# Altium schematic sheet bolid-outputs.SchDoc
size A3
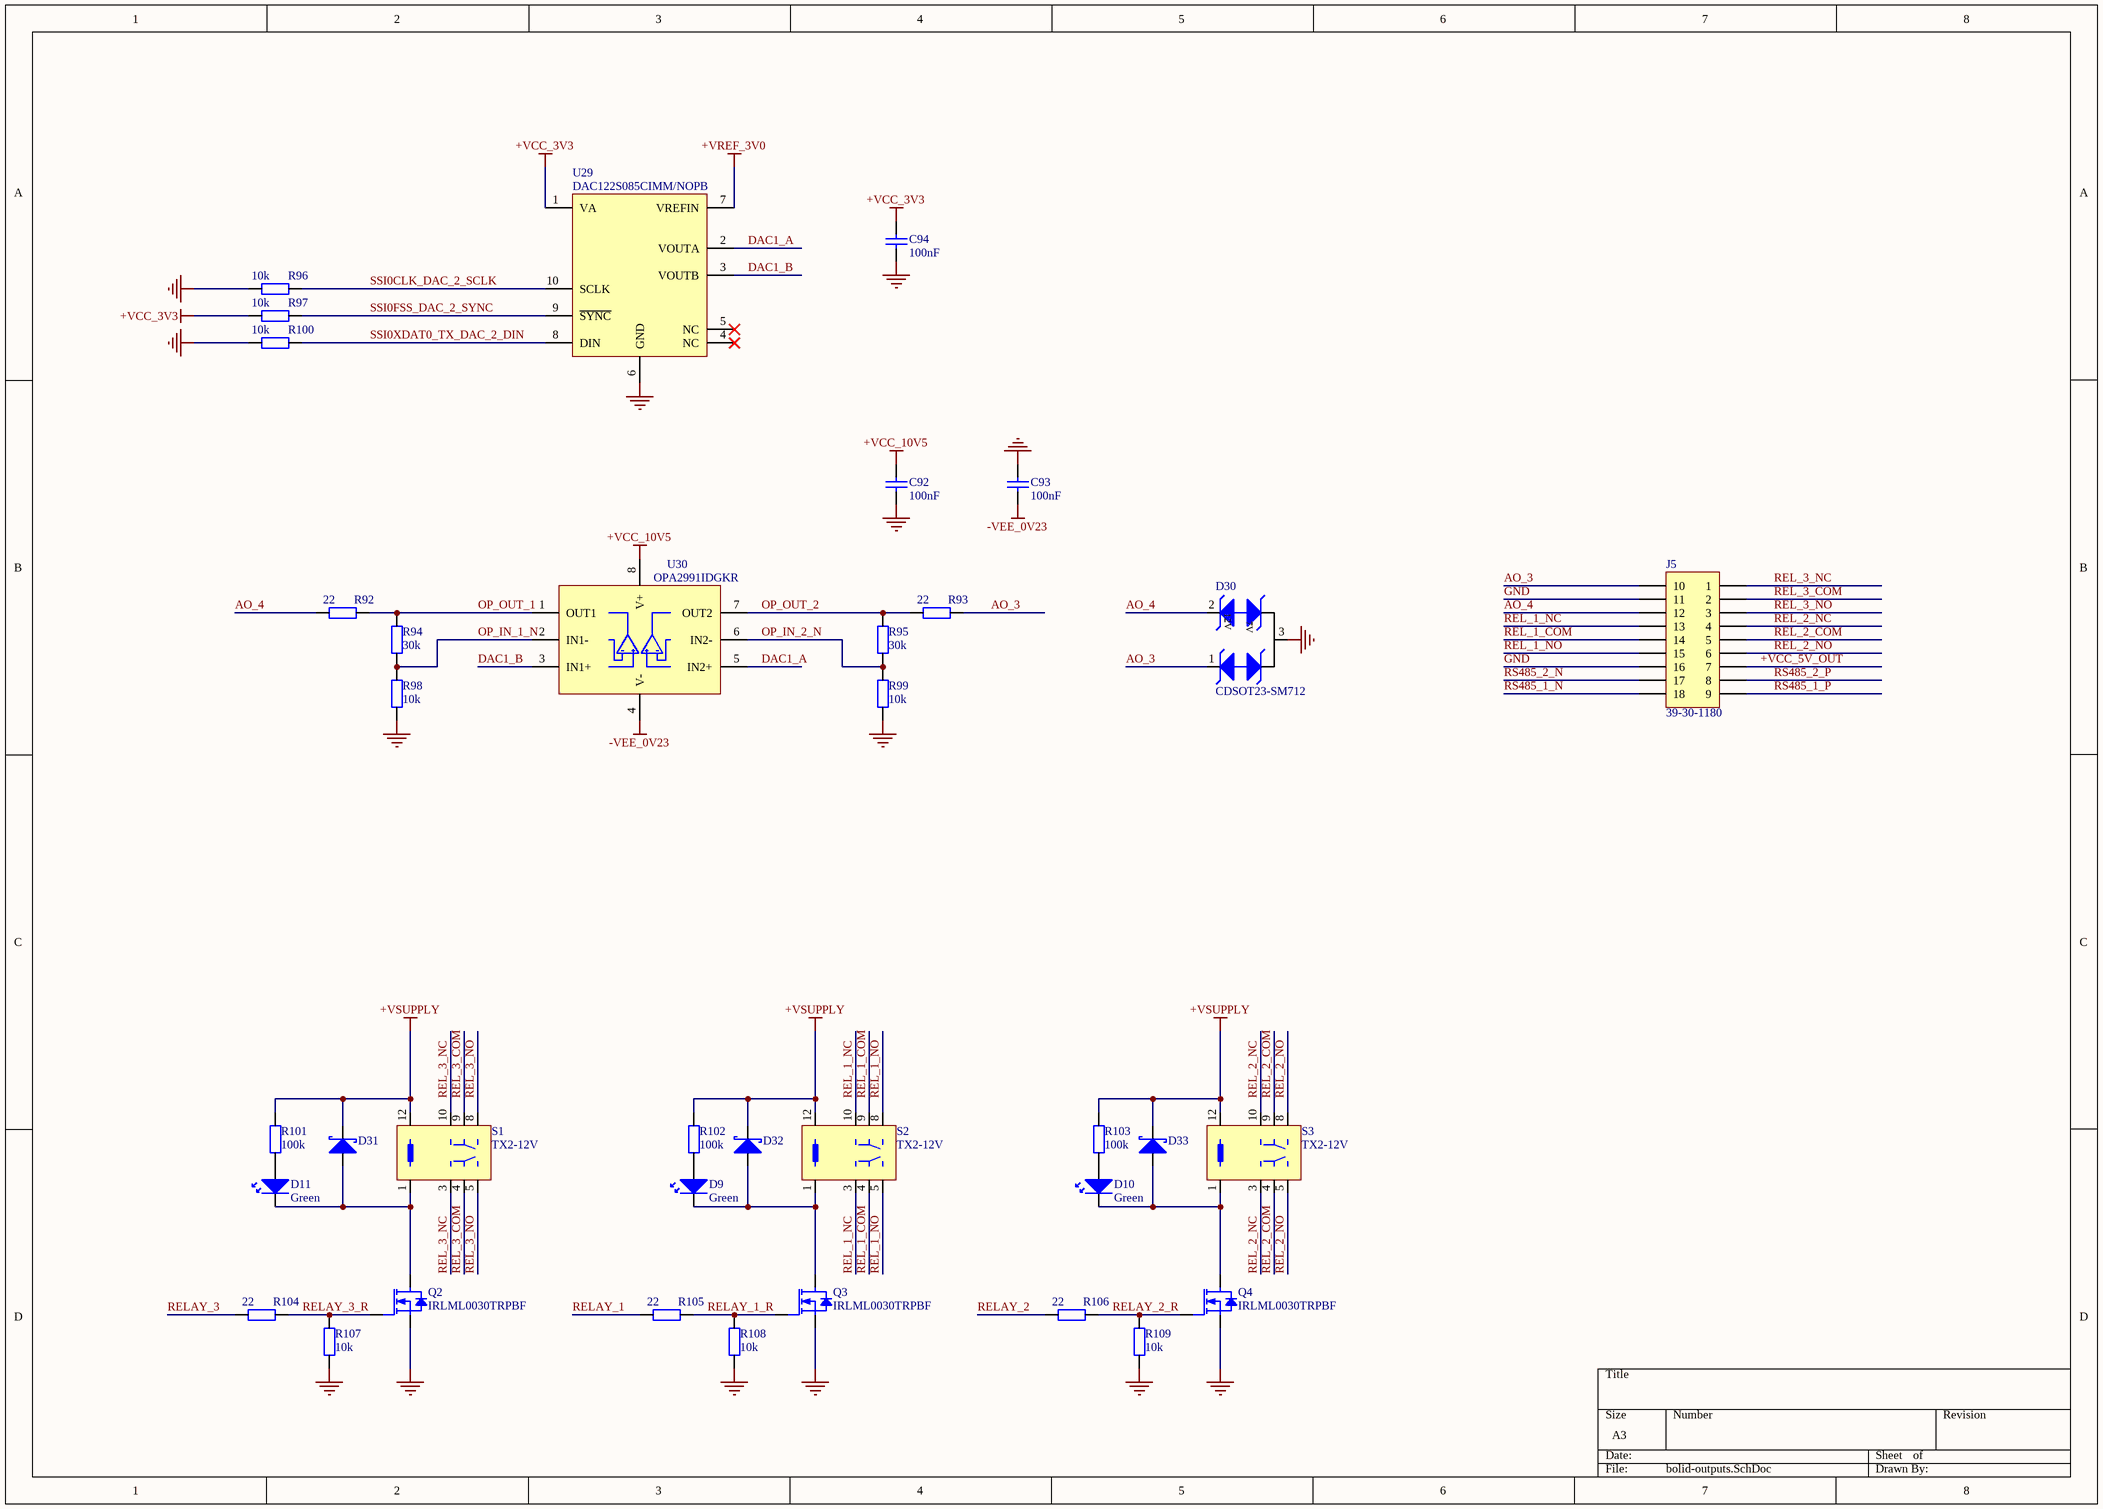
[diagram p0: bolid-outputs.SchDoc]

## Parts
C92  Value Displayed: 100nF  [C0402-CAPC100X50X55L22 - Tayio Yuden TDK]  (hidden comment: GRM155R71H104KE14D)
C93  Value Displayed: 100nF  [C0402-CAPC100X50X55L22 - Tayio Yuden TDK]  (hidden comment: GRM155R71H104KE14D)
C94  Value Displayed: 100nF  [C0402-CAPC100X50X55L22 - Tayio Yuden TDK]  (hidden comment: GRM155R71H104KE14D)
D9  Illumination Color: Green  [D0603 DIONC166X84X36L42N Littelfuse]  (hidden comment: 150060GS75000)
D10  Illumination Color: Green  [D0603 DIONC166X84X36L42N Littelfuse]  (hidden comment: 150060GS75000)
D11  Illumination Color: Green  [D0603 DIONC166X84X36L42N Littelfuse]  (hidden comment: 150060GS75000)
D30  CDSOT23-SM712  [Bourns SOT-23-3L SOT23-3P95_229X117L49X40N]
D31  MBR0530T3G  [SOD-123-2L SOD375X160X128L32X60N - Fairchild]  (value not drawn)
D32  MBR0530T3G  [SOD-123-2L SOD375X160X128L32X60N - Fairchild]  (value not drawn)
D33  MBR0530T3G  [SOD-123-2L SOD375X160X128L32X60N - Fairchild]  (value not drawn)
J5  39-30-1180  [MOLEX Mini-Fit Jr 039301180 2x9 PEG]
Q2  IRLML0030TRPBF  [SOT23-3P95_237X112L50X40N - Infineon Micro3]
Q3  IRLML0030TRPBF  [SOT23-3P95_237X112L50X40N - Infineon Micro3]
Q4  IRLML0030TRPBF  [SOT23-3P95_237X112L50X40N - Infineon Micro3]
R92  value 22  [R0402-RESC100X50X40L22N]  (hidden comment: RC0402FR-1322RL)
R93  value 22  [R0402-RESC100X50X40L22N]  (hidden comment: RC0402FR-1322RL)
R94  value 30k  [R0402-RESC100X50X40L22N]  (hidden comment: RC0402FR-1330KL)
R95  value 30k  [R0402-RESC100X50X40L22N]  (hidden comment: RC0402FR-1330KL)
R96  value 10k  [R0402-RESC100X50X40L22N]  (hidden comment: RC0402FR-0710KL)
R97  value 10k  [R0402-RESC100X50X40L22N]  (hidden comment: RC0402FR-0710KL)
R98  value 10k  [R0402-RESC100X50X40L22N]  (hidden comment: RC0402FR-0710KL)
R99  value 10k  [R0402-RESC100X50X40L22N]  (hidden comment: RC0402FR-0710KL)
R100  value 10k  [R0402-RESC100X50X40L22N]  (hidden comment: RC0402FR-0710KL)
R101  value 100k  [R0402-RESC100X50X40L22N]  (hidden comment: RC0402FR-07100KL)
R102  value 100k  [R0402-RESC100X50X40L22N]  (hidden comment: RC0402FR-07100KL)
R103  value 100k  [R0402-RESC100X50X40L22N]  (hidden comment: RC0402FR-07100KL)
R104  value 22  [R0402-RESC100X50X40L22N]  (hidden comment: RC0402FR-1322RL)
R105  value 22  [R0402-RESC100X50X40L22N]  (hidden comment: RC0402FR-1322RL)
R106  value 22  [R0402-RESC100X50X40L22N]  (hidden comment: RC0402FR-1322RL)
R107  value 10k  [R0402-RESC100X50X40L22N]  (hidden comment: RC0402FR-0710KL)
R108  value 10k  [R0402-RESC100X50X40L22N]  (hidden comment: RC0402FR-0710KL)
R109  value 10k  [R0402-RESC100X50X40L22N]  (hidden comment: RC0402FR-0710KL)
S1  TX2-12V  [NAiS_TX2]
S2  TX2-12V  [NAiS_TX2]
S3  TX2-12V  [NAiS_TX2]
U29  DAC122S085CIMM/NOPB  [TI VSSOP10 DGS0010A TSSOP50P490X110-10N]
U30  OPA2991IDGKR  [TI VSSOP8 DGK0008A TSOP65P490X110-8N]

## Nets
+VCC_3V3: C94.2 R97.2 U29.1(VA)
+VCC_10V5: C92.2 U30.8(V+)
+VREF_3V0: U29.7(VREFIN)
+VSUPPLY: D31.1(K) D32.1(K) D33.1(K) R101.2 R102.2 R103.2 S1.12 S2.12 S3.12
-VEE_0V23: C93.1 U30.4(V-)
GND: C92.1 C93.2 C94.1 D30.3 J5.11 J5.16 Q2.2(S) Q3.2(S) Q4.2(S) R96.2 R98.1 R99.1 R100.2 R107.1 R108.1 R109.1 U29.6(GND)
+VCC_5V_OUT: J5.7
AO_3: D30.1 J5.10 R93.2
AO_4: D30.2 J5.12 R92.1
DAC1_A: U29.2(VOUTA) U30.5(IN2+)
DAC1_B: U29.3(VOUTB) U30.3(IN1+)
OP_IN_1_N: R94.1 R98.2 U30.2(IN1-)
OP_IN_2_N: R95.1 R99.2 U30.6(IN2-)
OP_OUT_1: R92.2 R94.2 U30.1(OUT1)
OP_OUT_2: R93.1 R95.2 U30.7(OUT2)
REL_1_COM: J5.14 S2.4 S2.9
REL_1_NC: J5.13 S2.3 S2.10
REL_1_NO: J5.15 S2.5 S2.8
REL_2_COM: J5.5 S3.4 S3.9
REL_2_NC: J5.4 S3.3 S3.10
REL_2_NO: J5.6 S3.5 S3.8
REL_3_COM: J5.2 S1.4 S1.9
REL_3_NC: J5.1 S1.3 S1.10
REL_3_NO: J5.3 S1.5 S1.8
RELAY_1: R105.1
RELAY_1_R: Q3.1(G) R105.2 R108.2
RELAY_2: R106.1
RELAY_2_R: Q4.1(G) R106.2 R109.2
RELAY_3: R104.1
RELAY_3_R: Q2.1(G) R104.2 R107.2
RS485_1_N: J5.18
RS485_1_P: J5.9
RS485_2_N: J5.17
RS485_2_P: J5.8
SSI0CLK_DAC_2_SCLK: R96.1 U29.10(SCLK)
SSI0FSS_DAC_2_SYNC: R97.1 U29.9(~{SYNC})
SSI0XDAT0_TX_DAC_2_DIN: R100.1 U29.8(DIN)
NetD9_1: D9.1(K) D32.2(A) Q3.3(D) S2.1
NetD9_2: D9.2(A) R102.1
NetD10_1: D10.1(K) D33.2(A) Q4.3(D) S3.1
NetD10_2: D10.2(A) R103.1
NetD11_1: D11.1(K) D31.2(A) Q2.3(D) S1.1
NetD11_2: D11.2(A) R101.1

Not connected (* = marked no-connect by the designer): U29 4(NC)* 5(NC)*

## Notes on the sheet
- (in symbol CDSOT23-SM712) 7V

## Library data of the parts
C92-C94 = GRM155R71H104KE14D: MLCC 0402 (1005) 100nF 10% 50V X7R; Manufacturer: Murata Electronics; Capacitance: 0.1 uF; Type: Chip Multilayer Ceramic Capacitor for General Purpose; Voltage Rating DC: 50 VDC; Capacitance - pF: 100000 pF; Class: Class 2; Supplier 1: Mouser; Manufacturer Part Number: GRM155R71H104KE14D; RoHS: RoHS Compliant; Category: Multilayer Ceramic Capacitors MLCC - SMD/SMT; Stock 1: 3511637; Pricing 1: 1=0.090, 10=0.038, 100=0.016, 500=0.012, 1000=0.009, 2500=0.008, 5000=0.007, 10000=0.005 (EUR); Height: 0.5 mm; Length: 1 mm; Package / Case: 0402 (1005 metric); Packaging: Cut Tape; Product: General Type MLCCs; Series: GRM; Termination Style: SMD/SMT; Tolerance: 10 %; Width: 0.5 mm; Brand: Murata Electronics; Capacitance - nF: 100 nF; Case Code - in: 0402; Case Code - mm: 1005; Dielectric: X7R; Maximum Operating Temperature: + 125 C; Minimum Operating Temperature: - 55 C; Product Type: Ceramic Capacitors; Standard Pack Qty: 10000; Subcategory: Capacitors; Termination: Standard; RoHS - Mouser: Y; Minimum Order Quantity: 1; Reeling: True; ComponentLink1URL: https://www.mouser.com/datasheet/2/281/murata_03052018_GRM_Series_1-1310166.pdf; ComponentLink1Description: https://www.mouser.com/datasheet/2/281/murata_03052018_GRM_Series_1-1310166.pdf; Value: 100nF; Supplier Part Number 1: 81-GRM155R71H104KE4D
D9-D11 = 150060GS75000: LED 0603 (1608) Green; Manufacturer: Wurth Elektronik; Lens Color/Style: Water Clear; Power Rating: 105 mW; Lens Shape: Rectangular; Luminous Intensity: 430 mcd; Peak Wavelength: 515 nm; Viewing Angle: 140 deg; If - Forward Current: 20 mA; Vf - Forward Voltage: 3.2 V; Vr - Reverse Voltage: 5 V; Wavelength/Color Temperature: 520 nm; Supplier 1: Mouser; Manufacturer Part Number: 150060GS75000; RoHS: RoHS Compliant; Category: Standard LEDs - SMD; Stock 1: 17312; Pricing 1: 1=0.130, 10=0.126, 50=0.115, 100=0.099, 500=0.085, 4000=0.085 (EUR); Height: 0.7 mm; Length: 1.6 mm; Package / Case: 0603 (1608 metric); Packaging: Cut Tape; Product: Green LEDs; Series: WL-SMCW; Width: 0.8 mm; Brand: Wurth Elektronik; Mounting Style: SMD/SMT; Lens Dimensions: 1.1 mm x 0.8 mm; Lens Transparency: Water Clear; Maximum Operating Temperature: + 85 C; Minimum Operating Temperature: - 40 C; Moisture Sensitive: Yes; Product Type: LED - Standard; Standard Pack Qty: 4000; Subcategory: LEDs; RoHS - Mouser: Y; Minimum Order Quantity: 1; Reeling: True; ComponentLink1URL: https://www.mouser.com/datasheet/2/445/150060GS75000-368921.pdf; ComponentLink1Description: https://www.mouser.com/datasheet/2/445/150060GS75000-368921.pdf; Supplier Part Number 1: 710-150060GS75000
D30 = CDSOT23-SM712: TVS DIODE 7VWM/12VWM SOT23; Manufacturer: Bourns; Direction: Bidirectional; Capacitance: 75pF; Max Surge Current: 30A; Number of Elements: 2; Reverse Breakdown Voltage: 13.3V; Polarity: Bidirectional,Unidirectional; Clamping Voltage: 19V; Max Power Dissipation: 600W; Working Voltage: 12V; Peak Pulse Power: 400W; Power Line Protection: No; Leakage Current: 20uA; ESD Protection: Yes; Peak Pulse Current: 17A; Test Current: 1mA; Element Configuration: Dual; Diode Type: ZENER; Supplier 1: Mouser; Manufacturer Part Number: CDSOT23-SM712; RoHS: Yes; Category: TVS Diodes; Stock 1: 1112; Pricing 1: 1=1,63000, 10=1,44000, 50=1,44000, 100=1,14000, 250=1,11000, 500=0,94100, 1000=0,74300, 3000=0,69300, 6000=0,67500, 9000=0,62900, 10000=0,62900 (USD); Mount: Surface Mount; Case/Package: SOT-23; Number of Pins: 3; Contact Plating: Tin; Min Operating Temperature: -55°C; Max Operating Temperature: 150°C; Packaging: Tape and Reel; Package Quantity: 1; Number of Channels: 2; Breakdown Voltage: 13.3V; Termination: SMD/SMT; Number of Bidirectional Channels: 2; Reverse Standoff Voltage: 12V; Min Breakdown Voltage: 13.3V; Power Dissipation: 400W; Max Reverse Leakage Current: 20uA; Max Breakdown Voltage: 13.3V; Resistor Type: Zener; Series: -; Length: 3.04mm; Width: 0.055inch; Height: 1.11mm; Depth: 1.4mm; Radiation Hardening: No; REACH SVHC: No SVHC; RoHS Compliant: Yes; ComponentLink1URL: https://datasheet.ciiva.com/1281/1670933-1281331.pdf?src-supplier=Farnell; ComponentLink1Description: https://datasheet.ciiva.com/1281/1670933-1281331.pdf?src-supplier=Farnell; ComponentLink2URL: https://datasheet.ciiva.com/4510/cdsot23-sm712-25932-4510261.pdf?src-supplier=Mouser; ComponentLink2Description: https://datasheet.ciiva.com/4510/cdsot23-sm712-25932-4510261.pdf?src-supplier=Mouser; ComponentLink3URL: https://datasheet.ciiva.com/11193/cdsot23-sm712-11193846.pdf?src-supplier=Avnet; ComponentLink3Description: https://datasheet.ciiva.com/11193/cdsot23-sm712-11193846.pdf?src-supplier=Avnet; ComponentLink4URL: https://datasheet.ciiva.com/22696/1670933-22696779.pdf?src-supplier=Element14; ComponentLink4Description: https://datasheet.ciiva.com/22696/1670933-22696779.pdf?src-supplier=Element14; ComponentLink5URL: https://datasheet.ciiva.com/26828/getdatasheetpartid-418501-26828522.pdf?src-supplier=Verical; ComponentLink5Description: https://datasheet.ciiva.com/26828/getdatasheetpartid-418501-26828522.pdf?src-supplier=Verical; ComponentLink6URL: https://datasheet.ciiva.com/337/cdsot23-sm712-337451.pdf?src-supplier=Digi-Key; ComponentLink6Description: https://datasheet.ciiva.com/337/cdsot23-sm712-337451.pdf?src-supplier=Digi-Key; ComponentLink7URL: https://datasheet.ciiva.com/337/cdsot23-sm712-337452.pdf?src-supplier=Digi-Key; ComponentLink7Description: https://datasheet.ciiva.com/337/cdsot23-sm712-337452.pdf?src-supplier=Digi-Key; Supplier Part Number 1: 652-CDSOT23-SM712
D31-D33 = MBR0530T3G: ON Semi MBR0530T3G; SMT Schottky Diode; 30V 500mA; 2-Pin SOD-123; Manufacturer: ON Semiconductor; Supplier 1: Mouser; Manufacturer Part Number: MBR0530T3G; RoHS: Yes; Category: Schottky Diodes; Stock 1: 167531; Pricing 1: 1=0,19, 10=0,126, 50=0,126, 100=0,065, 1000=0,053, 10000=0,041 (USD); ComponentLink1URL: https://datasheet.ciiva.com/6381/mbr0530t1-d-6381904.pdf?src-supplier=Digikey; ComponentLink1Description: https://datasheet.ciiva.com/6381/mbr0530t1-d-6381904.pdf?src-supplier=Digikey; ComponentLink2URL: https://datasheet.ciiva.com/7962/85890-7962703.pdf?src-supplier=Element14; ComponentLink2Description: https://datasheet.ciiva.com/7962/85890-7962703.pdf?src-supplier=Element14; ComponentLink3URL: https://datasheet.ciiva.com/8294/mbr0530t1-d-8294572.pdf?src-supplier=Avnet; ComponentLink3Description: https://datasheet.ciiva.com/8294/mbr0530t1-d-8294572.pdf?src-supplier=Avnet; ComponentLink4URL: https://datasheet.ciiva.com/15144/getdatasheetpartid-86762-15144599.pdf?src-supplier=Verical; ComponentLink4Description: https://datasheet.ciiva.com/15144/getdatasheetpartid-86762-15144599.pdf?src-supplier=Verical; ComponentLink5URL: https://datasheet.ciiva.com/6381/mbr0530t1-d-6381902.pdf?src-supplier=Digikey; ComponentLink5Description: https://datasheet.ciiva.com/6381/mbr0530t1-d-6381902.pdf?src-supplier=Digikey; Supplier Part Number 1: 863-MBR0530T3G
J5 = 039301180: Molex MiniFit Jr 2x9 Peg Connector Wire to Board Header 18 Position 4.2mm Solder Right Angle Thru-Hole Tray; Supplier 1: Mouser; Manufacturer: Molex; Manufacturer Part Number: 39-30-1180; RoHS: Yes; Category: Headers and Wire Housings; Stock 1: 1289; Pricing 1: 1=2,04, 10=1,55, 50=1,55, 100=1,44, 1000=1,44, 10000=1,39 (USD); Supplier Part Number 1: 538-39-30-1180
Q2-Q4 = IRLML0030TRPBF: MOSFET MOSFT 30V 5.2A 28mOhm 3.6nC Qg; Manufacturer: Infineon Technologies; Configuration: Single; Transistor Type: 1 N-Channel; Forward Transconductance - Min: 9.5 s; Number of Channels: 1 Channel; Transistor Polarity: N-Channel; Channel Mode: Enhancement; Fall Time: 4.4 ns; Id - Continuous Drain Current: 5.3 A; Pd - Power Dissipation: 1.3 W; Qg - Gate Charge: 2.6 nC; Rds On - Drain-Source Resistance: 27 mOhms; Typical Turn-Off Delay Time: 7.4 ns; Typical Turn-On Delay Time: 5.2 ns; Vgs - Gate-Source Voltage: 10 V; Vgs th - Gate-Source Threshold Voltage: 1.3 V; Supplier 1: Mouser; Manufacturer Part Number: IRLML0030TRPBF; RoHS: RoHS Compliant; Category: MOSFET; Stock 1: 29537; Pricing 1: 1=0.360, 10=0.280, 100=0.151, 1000=0.113, 3000=0.098, 9000=0.092 (EUR); Height: 1.1 mm; Length: 2.9 mm; Package / Case: SOT-23-3; Packaging: Cut Tape; Technology: Si; Width: 1.3 mm; Brand: Infineon Technologies; Mounting Style: SMD/SMT; Maximum Operating Temperature: + 150 C; Minimum Operating Temperature: - 55 C; Product Type: MOSFET; Rise Time: 4.4 ns; Standard Pack Qty: 3000; Subcategory: MOSFETs; Vds - Drain-Source Breakdown Voltage: 30 V; RoHS - Mouser: Y; Minimum Order Quantity: 1; Reeling: True; ComponentLink1URL: https://www.mouser.com/datasheet/2/196/irlml0030pbf-1228561.pdf; ComponentLink1Description: https://www.mouser.com/datasheet/2/196/irlml0030pbf-1228561.pdf; Supplier Part Number 1: 942-IRLML0030TRPBF
R92 R93 R104-R106 = RC0402FR-1322RL: RES 0402 (1005) 22.0 ohm 1% 0.0625W 50V Thick Film; Manufacturer: Yageo; Resistance: 22R; Power Rating: 62.5mW; Temperature Coefficient: 100ppm/°C; Supplier 1: Mouser; Manufacturer Part Number: RC0402FR-1322RL; RoHS: Yes; Category: Chip SMD Resistors; Stock 1: 130563; Pricing 1: 1=0,10000, 10=0,01200, 50=0,01200, 100=0,00500, 1000=0,00300, 10000=0,00300 (USD); Case/Package: 0402; Case Code (Imperial): 0402; Case Code (Metric): 1005; Weight: 2.3E-05oz; Contact Plating: Tin,Matte; Size Code: 0402; Min Operating Temperature: -55°C; Max Operating Temperature: 155°C; Voltage Rating: 50V; Tolerance: 1%; Packaging: Tape and Reel; Resistor Type: Thick Film; Termination: SMD/SMT; Series: RC; Length: 1mm; Width: 0.5mm; Height: 0.35mm; Radiation Hardening: No; Lead Free: Lead Free; RoHS Compliant: Yes; ComponentLink1URL: https://datasheet.ciiva.com/17423/pyu-rc0402-51-rohs-l-6-r-17423721.pdf?src-supplier=Future+Electronics; ComponentLink1Description: https://datasheet.ciiva.com/17423/pyu-rc0402-51-rohs-l-6-r-17423721.pdf?src-supplier=Future+Electronics; ComponentLink2URL: https://datasheet.ciiva.com/8890/pyu-rc0402-51-rohs-l-6-8890187.pdf?src-supplier=Avnet; ComponentLink2Description: https://datasheet.ciiva.com/8890/pyu-rc0402-51-rohs-l-6-8890187.pdf?src-supplier=Avnet; Supplier Part Number 1: 603-RC0402FR-1322RL
R94 R95 = RC0402FR-1330KL: RES 0402 (1005) 30.0k 1% 0.0625W 50V Thick Film; Manufacturer: Yageo; Resistance: 30kR; Temperature Coefficient: 100ppm/°C; Supplier 1: Mouser; Manufacturer Part Number: RC0402FR-1330KL; Category: Chip SMD Resistors; Stock 1: 14386; Pricing 1: 1=0,10000, 10=0,01700, 50=0,01700, 100=0,00700, 1000=0,00400, 10000=0,00200 (USD); Case/Package: 0402; Contact Plating: Tin; Min Operating Temperature: -55°C; Max Operating Temperature: 155°C; Tolerance: 1%; Resistor Type: Thick Film; Radiation Hardening: No; RoHS Compliant: Yes; ComponentLink1URL: https://datasheet.ciiva.com/8889/pyu-rc0402-51-rohs-l-6-8889740.pdf?src-supplier=Avnet; ComponentLink1Description: https://datasheet.ciiva.com/8889/pyu-rc0402-51-rohs-l-6-8889740.pdf?src-supplier=Avnet; ComponentLink2URL: https://datasheet.octopart.com/RC0402FR-1330KL-Yageo-datasheet-10408619.pdf?src-supplier=_legacy+Avnet; ComponentLink2Description: https://datasheet.octopart.com/RC0402FR-1330KL-Yageo-datasheet-10408619.pdf?src-supplier=_legacy+Avnet; ComponentLink3URL: https://datasheet.octopart.com/RC0402FR-1330KL-Yageo-datasheet-73766026.pdf; ComponentLink3Description: https://datasheet.octopart.com/RC0402FR-1330KL-Yageo-datasheet-73766026.pdf; Supplier Part Number 1: 603-RC0402FR-1330KL
R96-R100 R107-R109 = RC0402FR-0710KL: RES 0402 (1005) 10.0k 1% 0.0625W 50V Thick Film; Manufacturer: Yageo; Power Rating: 62.5 mW, 125 mW; Resistance: 10 kOhms; Temperature Coefficient: 100 PPM / C; Supplier 1: Mouser; Manufacturer Part Number: RC0402FR-0710KL; RoHS: RoHS Compliant; Category: Thick Film Resistors - SMD; Stock 1: 20942447; Pricing 1: 1=0.090, 10=0.011, 100=0.004, 1000=0.003, 10000=0.003 (EUR); Application: High Reliability; Features: -; Height: 0.35 mm; Length: 1 mm; Package / Case: -; Packaging: Cut Tape; Product: Thick Film Resistors SMD; Series: RC; Technology: Thick Film; Termination Style: SMD/SMT; Tolerance: 1 %; Type: General Purpose; Voltage Rating: 50 V; Width: 0.5 mm; Brand: Yageo; Mounting Style: PCB Mount; Case Code - in: 0402; Case Code - mm: 1005; Maximum Operating Temperature: + 155 C; Minimum Operating Temperature: - 55 C; Product Type: Thick Film Resistors; Standard Pack Qty: 10000; Subcategory: Resistors; RoHS - Mouser: Y; Minimum Order Quantity: 1; Reeling: True; ComponentLink1URL: https://www.mouser.com/datasheet/2/447/PYu-RC_Group_51_RoHS_L_10-1664068.pdf; ComponentLink1Description: https://www.mouser.com/datasheet/2/447/PYu-RC_Group_51_RoHS_L_10-1664068.pdf; Supplier Part Number 1: 603-RC0402FR-0710KL
R101-R103 = RC0402FR-07100KL: RES 0402 (1005) 100.0k 1% 0.0625W 50V Thick Film; Manufacturer: Yageo; Power Rating: 62.5 mW, 125 mW; Resistance: 100 kOhms; Temperature Coefficient: 100 PPM / C; Supplier 1: Mouser; Manufacturer Part Number: RC0402FR-07100KL; RoHS: RoHS Compliant; Category: Thick Film Resistors - SMD; Stock 1: 2491111; Pricing 1: 1=0.090, 10=0.011, 100=0.004, 1000=0.003, 10000=0.003 (EUR); Application: High Reliability; Features: -; Height: 0.35 mm; Length: 1 mm; Package / Case: -; Packaging: Cut Tape; Product: Thick Film Resistors SMD; Series: RC; Technology: Thick Film; Termination Style: SMD/SMT; Tolerance: 1 %; Type: General Purpose; Voltage Rating: 50 V; Width: 0.5 mm; Brand: Yageo; Mounting Style: PCB Mount; Case Code - in: 0402; Case Code - mm: 1005; Maximum Operating Temperature: + 155 C; Minimum Operating Temperature: - 55 C; Product Type: Thick Film Resistors; Standard Pack Qty: 10000; Subcategory: Resistors; RoHS - Mouser: Y; Minimum Order Quantity: 1; Reeling: True; ComponentLink1URL: https://www.mouser.com/datasheet/2/447/PYu-RC_Group_51_RoHS_L_10-1664068.pdf; ComponentLink1Description: https://www.mouser.com/datasheet/2/447/PYu-RC_Group_51_RoHS_L_10-1664068.pdf; Supplier Part Number 1: 603-RC0402FR-07100KL
S1-S3 = TX2-12V: Electromechanical Relay 12VDC 1.028KOhm 2A DPDT (15x7.4x8.2)mm THT General Purpose Relay; Manufacturer: Panasonic; Coil Current: 11.7mA; Coil Resistance: 1.028kR; Coil Voltage (DC): 12V; Max Voltage Rating (DC): 220V; Coil Type: Non-Latching; Power Consumption: 140mW; Operate Time: 4ms; Relay Type: Telecom; Insertion Loss: 0.8dB; Number of Poles: 2; Power Rating: 60W; Test Voltage: 2kV; Life (Hours): 1Hour; Pitch: 2.54mm; Hole Diameter: 1mm; Ratings: IP67; Approvals: UL,CSA; Supplier 1: Mouser; Manufacturer Part Number: TX2-12V; RoHS: Yes; Category: Signal Relays; Stock 1: 2161; Pricing 1: 1=3,78000, 10=3,54000, 50=3,15000, 100=3,15000, 1000=2,20000, 10000=2,12000 (USD); Mount: Through Hole,PCB; Case/Package: DIP; Number of Pins: 8; Contact Material: Gold,Silver; Weight: 2g; Contact Plating: Gold; Min Operating Temperature: -40°C; Max Operating Temperature: 85°C; Package Quantity: 40; Packaging: Rail/Tube; Throw Configuration: DPDT; Max Current Rating: 2A; Termination: PC Pin; Series: TX; Contact Current Rating: 2A; Release Time: 4ms; Coil Power: 140mW; Voltage Rating (DC): 220V; Current Rating: 2A; Switching Current: 2A; Length: 15mm; Width: 7.4mm; Height: 8.2mm; Depth: 7.4mm; Lead Pitch: 2.54mm; Radiation Hardening: No; Lead Free: Lead Free; RoHS Compliant: Yes; Reach SVHC Compliant: Yes; ComponentLink1URL: https://datasheet.ciiva.com/26917/getdatasheetpartid-163318-26917772.pdf?src-supplier=Verical; ComponentLink1Description: https://datasheet.ciiva.com/26917/getdatasheetpartid-163318-26917772.pdf?src-supplier=Verical; ComponentLink2URL: https://datasheet.ciiva.com/14532/70158490-14532423.pdf?src-supplier=Allied+Electronics; ComponentLink2Description: https://datasheet.ciiva.com/14532/70158490-14532423.pdf?src-supplier=Allied+Electronics; ComponentLink3URL: https://datasheet.ciiva.com/2416/tx2-relays-2416825.pdf?src-supplier=Digi-Key; ComponentLink3Description: https://datasheet.ciiva.com/2416/tx2-relays-2416825.pdf?src-supplier=Digi-Key; ComponentLink4URL: https://datasheet.ciiva.com/30180/82ds-61022-en-tx-30180027.pdf?src-supplier=Onlinecomponents.com; ComponentLink4Description: https://datasheet.ciiva.com/30180/82ds-61022-en-tx-30180027.pdf?src-supplier=Onlinecomponents.com; Supplier Part Number 1: 769-TX2-12V
U29 = DAC122S085CIMM/NOPB: 12-Bit Micro Power DUAL Digital-to-Analog Converter with ail-to- ail Output 10-VSSOP -40 to 105; Manufacturer: TI National Semiconductor; Supplier 1: Mouser; Manufacturer Part Number: DAC122S085CIMM/NOPB; RoHS: Yes; Category: Digital to Analog Converters (DACs); Stock 1: 2044; Pricing 1: 1=5,24, 10=3,75, 50=3,75, 100=3,36, 1000=3,07, 10000=2,94 (USD); ComponentLink1URL: https://datasheet.ciiva.com/41460/001186508-da-01-en-ic-dac-1-dac122s085cimm-nopb-msop-10-tid-41460669.pdf?src-supplier=Conrad; ComponentLink1Description: https://datasheet.ciiva.com/41460/001186508-da-01-en-ic-dac-1-dac122s085cimm-nopb-msop-10-tid-41460669.pdf?src-supplier=Conrad; ComponentLink2URL: https://datasheet.ciiva.com/3041/dac122s085-3041128.pdf?src-supplier=Avnet; ComponentLink2Description: https://datasheet.ciiva.com/3041/dac122s085-3041128.pdf?src-supplier=Avnet; ComponentLink3URL: https://datasheet.ciiva.com/49118/1851000-49118556.pdf?src-supplier=Element14; ComponentLink3Description: https://datasheet.ciiva.com/49118/1851000-49118556.pdf?src-supplier=Element14; ComponentLink4URL: https://datasheet.ciiva.com/15146/getdatasheetpartid-142727-15146634.pdf?src-supplier=Verical; ComponentLink4Description: https://datasheet.ciiva.com/15146/getdatasheetpartid-142727-15146634.pdf?src-supplier=Verical; ComponentLink5URL: https://datasheet.ciiva.com/6665/dac122s085-6665055.pdf?src-supplier=Digikey; ComponentLink5Description: https://datasheet.ciiva.com/6665/dac122s085-6665055.pdf?src-supplier=Digikey; Supplier Part Number 1: 926-DAC122S085CIMMNO
U30 = OPA2991IDGKR: 40-V, dual 4.5MHz, rail-to-rail input/output, low-offset-voltage, low-noise op amp 8-VSSOP -40 to 125; Manufacturer: Texas Instruments; Supplier 1: Mouser; Manufacturer Part Number: OPA2991IDGKR; RoHS: No; Category: Amplifiers - Op Amps, Buffer, Instrumentation; Stock 1: 17209; Pricing 1: 1=1,92, 10=1,29, 50=1,29, 100=1,13, 1000=0,943, 10000=0,863 (USD); Supplier Part Number 1: 595-OPA2991IDGKR